# Altium project PCB_Project1.PrjPCB
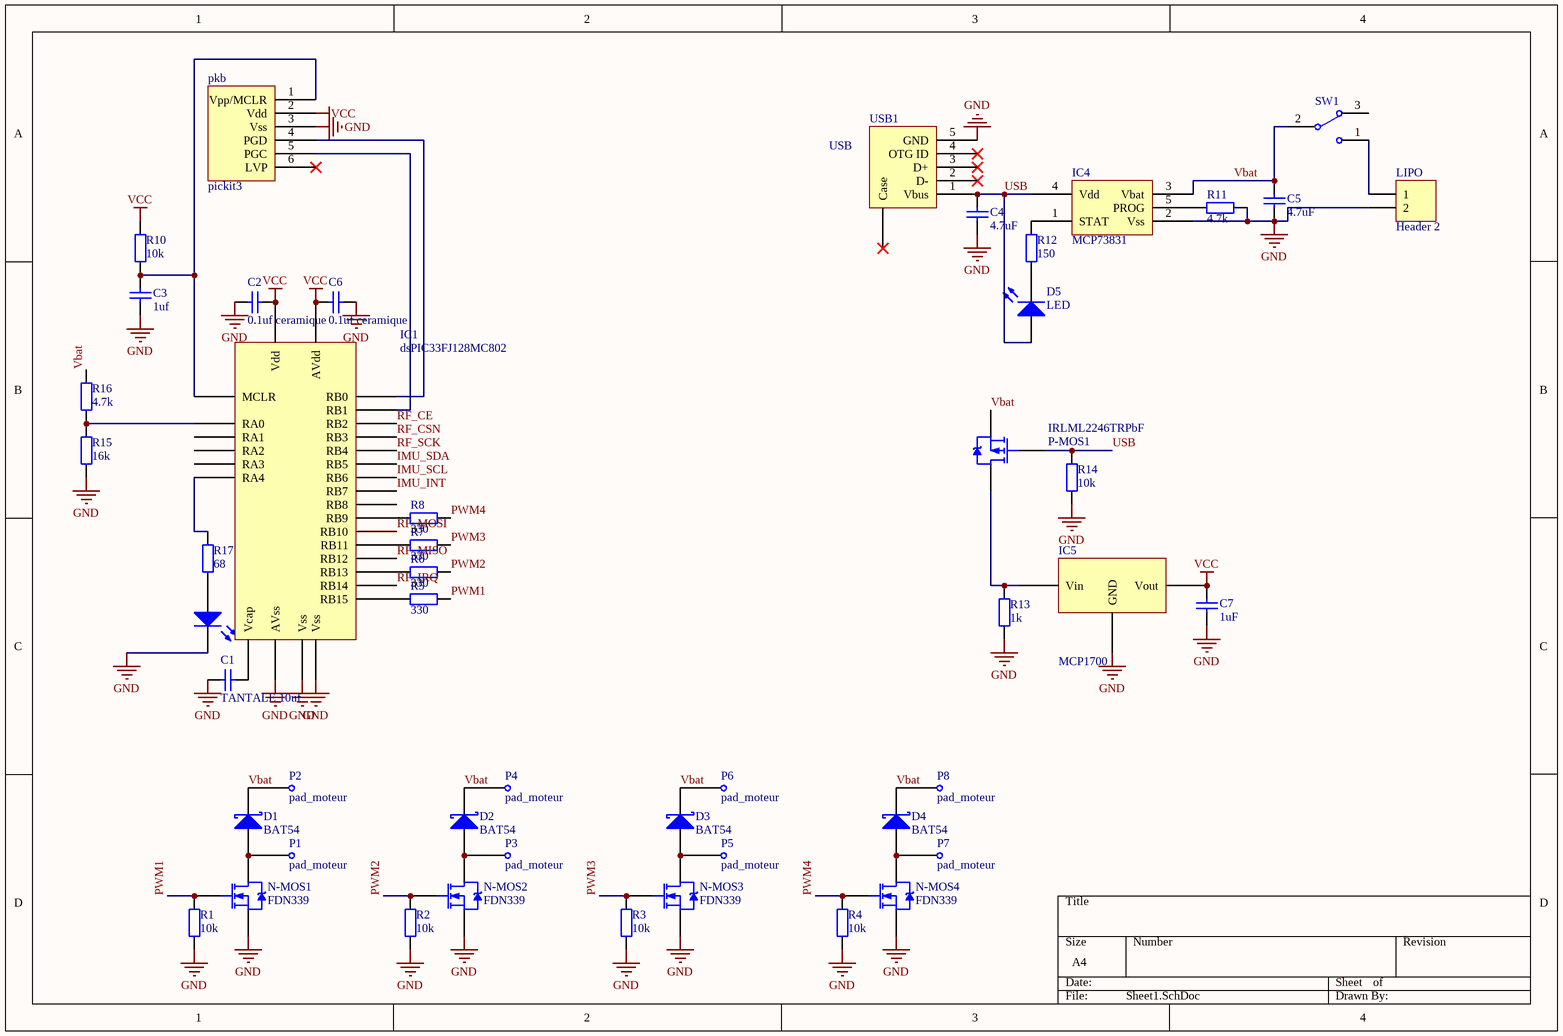
[diagram p0: Sheet1.SchDoc]
2 sheets, 71 parts. Net scope: global (net labels, ports and power ports of the same name join across sheets).
Board file: PCB1_jeremy.PcbDoc
Sheets:
  Sheet1.SchDoc
  Sheet2.SchDoc

## Sheet Sheet1.SchDoc
size A4; PageSetup: Record=PageOptions|CenterHorizontal=True|CenterVertical=True|PrintScale=0.97|XCorrection=1.00|YCorrection=1.00|PrintKind=1|BorderSize=5000000|LeftOffset=0|BottomOffset=0|Orientation=2|PaperLength=1000|PaperWidth=1000|Scale=100|PaperSource=7|PrintQuality=-4|MediaType=1|DitherType=1|PaperKind=A4|PrintScaleMode=1

### Parts
C1  TANTALE 10uf  [cms805]
C2  0.1uf ceramique  [cms805]
C3  1uf  [cms805]
C4  4.7uF  [cms805]
C5  4.7uF  [cms805]
C6  0.1uf ceramique  [cms805]
C7  1uF  [cms805]
D1  BAT54  [SOT23]
D2  BAT54  [SOT23]
D3  BAT54  [SOT23]
D4  BAT54  [SOT23]
D5  LED  [cms1206]
D6  LED  [cms1206]
IC1  dsPIC33FJ128MC802  [28QFN-S]
IC4  MCP73831  [SOT23-5]
IC5  MCP1700  [SOT89]
IRLML2246TRPbF  P-MOS1  [SOT23]
LIPO  Header 2  [HDR1X2]
N-MOS1  FDN339  [SuperSOT]
N-MOS2  FDN339  [SuperSOT]
N-MOS3  FDN339  [SuperSOT]
N-MOS4  FDN339  [SuperSOT]
P1  pad_moteur  [PAD]
P2  pad_moteur  [PAD]
P3  pad_moteur  [PAD]
P4  pad_moteur  [PAD]
P5  pad_moteur  [PAD]
P6  pad_moteur  [PAD]
P7  pad_moteur  [PAD]
P8  pad_moteur  [PAD]
pkb  pickit3  [pickit3]
R1  10k  [cms805]
R2  10k  [cms805]
R3  10k  [cms805]
R4  10k  [cms805]
R5  330  [cms805]
R6  330  [cms805]
R7  330  [cms805]
R8  330  [cms805]
R10  10k  [cms805]
R11  4.7k  [cms805]
R12  150  [cms805]
R13  1k  [cms805]
R14  10k  [cms805]
R15  16k  [cms805]
R16  4.7k  [cms805]
R17  68  [cms805]
SW1  (no value)  [inverseur]
USB1  USB  [USB_con]

### Nets
GND: C1.1 C2.1 C3.1 C4.1 C5.1 C6.2 C7.1 D6.2(K) IC1.8(Vss) IC1.19(Vss) IC1.27(AVss) IC4.2(Vss) IC5.1(GND) LIPO.2 N-MOS1.3(S) N-MOS2.3(S) N-MOS3.3(S) N-MOS4.3(S) pkb.3(Vss) R1.1 R2.1 R3.1 R4.1 R11.1 R13.1 R14.1 R15.1 USB1.5(GND)
VCC: C2.2 C6.1 C7.2 IC1.13(Vdd) IC1.28(AVdd) IC5.3(Vout) pkb.2(Vdd) R10.2
IMU_INT: IC1.16(RB7)
IMU_SCL: IC1.15(RB6)
IMU_SDA: IC1.14(RB5)
PWM1: N-MOS1.1(G) R1.2 R5.2
PWM2: N-MOS2.1(G) R2.2 R6.2
PWM3: N-MOS3.1(G) R3.2 R7.2
PWM4: N-MOS4.1(G) R4.2 R8.2
RF_CE: IC1.6(RB2)
RF_CSN: IC1.7(RB3)
RF_IRQ: IC1.25(RB14)
RF_MISO: IC1.23(RB12)
RF_MOSI: IC1.21(RB10)
RF_SCK: IC1.11(RB4)
USB: C4.2 D5.1(A) IC4.4(Vdd) IRLML2246TRPbF.1(G) R14.2 USB1.1(Vbus)
Vbat: C5.2 D1.2(K) D2.2(K) D3.2(K) D4.2(K) IC4.3(Vbat) IRLML2246TRPbF.3(S) P2.1 P4.1 P6.1 P8.1 R16.2 SW1.2
NetC1_2: C1.2 IC1.20(Vcap)
NetC3_2: C3.2 IC1.1(MCLR) pkb.1(Vpp/MCLR) R10.1
NetD1_1: D1.1(A) N-MOS1.2(D) P1.1
NetD2_1: D2.1(A) N-MOS2.2(D) P3.1
NetD3_1: D3.1(A) N-MOS3.2(D) P5.1
NetD4_1: D4.1(A) N-MOS4.2(D) P7.1
NetD5_2: D5.2(K) R12.2
NetD6_1: D6.1(A) R17.1
NetIC1_2: IC1.2(RA0) R15.2 R16.1
NetIC1_4: IC1.4(RB0) pkb.4(PGD)
NetIC1_5: IC1.5(RB1) pkb.5(PGC)
NetIC1_12: IC1.12(RA4) R17.2
NetIC1_18: IC1.18(RB9) R8.1
NetIC1_22: IC1.22(RB11) R7.1
NetIC1_24: IC1.24(RB13) R6.1
NetIC1_26: IC1.26(RB15) R5.1
NetIC4_1: IC4.1(STAT) R12.1
NetIC4_5: IC4.5(PROG) R11.2
NetIC5_2: IC5.2(Vin) IRLML2246TRPbF.2(D) R13.2
NetLIPO_1: LIPO.1 SW1.1

Not connected (* = marked no-connect by the designer): IC1 3(RA1) 9(RA2) 10(RA3) 17(RB8); pkb 6(LVP)*; SW1 3; USB1 0(Case)* 2(D-)* 3(D+)* 4(OTG_ID)*

### Library data of the parts
C1-C7 = Capa
D1-D4 = Schottky BAT54
IC1 = dsPIC33FJ128MC802: pin to pad: 1>26 2>27 3>28 4>1 5>2 6>3 7>4 8>5 9>6 10>7 11>8 12>9 13>10 14>11 15>12 16>13 17>14 18>15 19>16 20>17 21>18 22>19 23>20 24>21 25>22 26>23 27>24 28>25
IC4 = MCP73831 Li-Po
IRLML2246TRPbF = P-MOS
LIPO = Header 2: Header, 2-Pin; LatestRevisionDate: 17-Jul-2002; LatestRevisionNote: Re-released for DXP Platform.; Publisher: Altium Limited
N-MOS1-N-MOS4 = N-MOS FDN339
R1-R8 R10-R17 = Resistance
SW1 = switch

## Sheet Sheet2.SchDoc
size A4
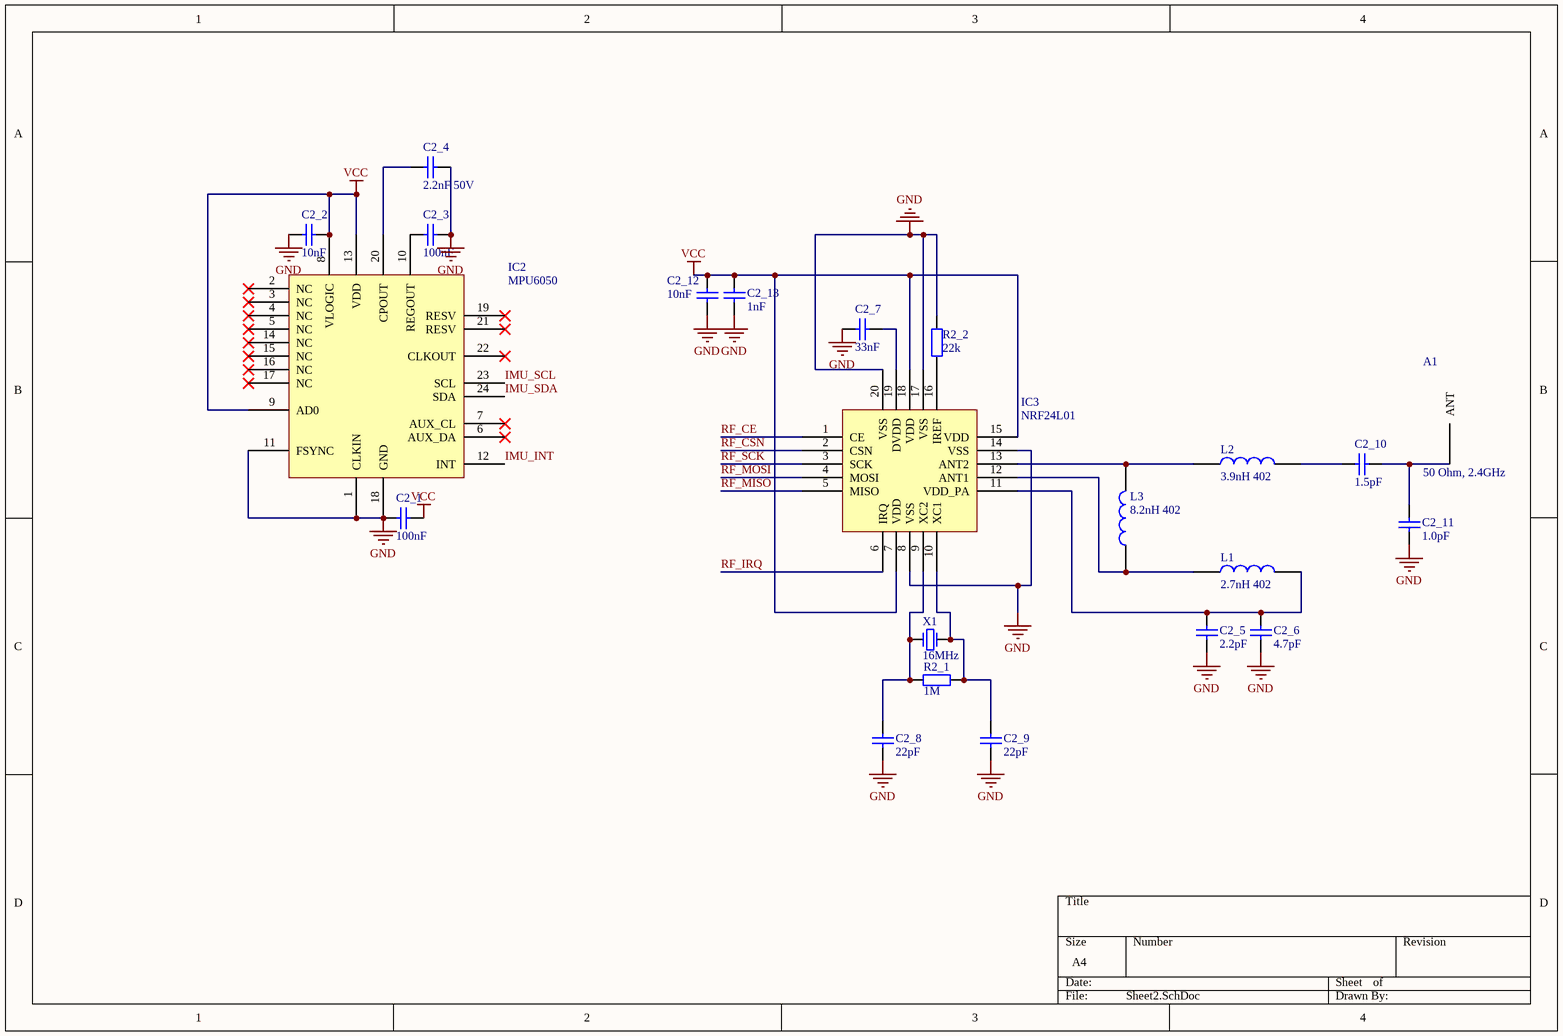
[diagram p1: Sheet2.SchDoc]

### Parts
A1  50 Ohm, 2.4GHz  [Antene]
C2_1  100nF  [cms805]
C2_2  10nF  [cms805]
C2_3  100nF  [cms805]
C2_4  2.2nF 50V  [cms805]
C2_5  2.2pF  [cms805]
C2_6  4.7pF  [cms805]
C2_7  33nF  [cms805]
C2_8  22pF  [cms805]
C2_9  22pF  [cms805]
C2_10  1.5pF  [cms805]
C2_11  1.0pF  [cms805]
C2_12  10nF  [cms805]
C2_13  1nF  [cms805]
IC2  MPU6050  [24QFN]
IC3  NRF24L01  [20QFN]
L1  2.7nH 402  [CMS402]
L2  3.9nH 402  [CMS402]
L3  8.2nH 402  [CMS402]
R2_1  1M  [cms805]
R2_2  22k  [cms805]
X1  16MHz  [Quartz]

### Nets
GND: C2_1.1 C2_2.2 C2_3.2 C2_4.1 C2_5.2 C2_6.2 C2_7.2 C2_8.1 C2_9.1 C2_11.2 C2_12.2 C2_13.2 IC2.1(CLKIN) IC2.11(FSYNC) IC2.18(GND) IC3.8(VSS) IC3.14(VSS) IC3.17(VSS) IC3.20(VSS) R2_2.2
VCC: C2_1.2 C2_2.1 C2_12.1 C2_13.1 IC2.8(VLOGIC) IC2.9(AD0) IC2.13(VDD) IC3.7(VDD) IC3.15(VDD) IC3.18(VDD)
IMU_INT: IC2.12(INT)
IMU_SCL: IC2.23(SCL)
IMU_SDA: IC2.24(SDA)
RF_CE: IC3.1(CE)
RF_CSN: IC3.2(CSN)
RF_IRQ: IC3.6(IRQ)
RF_MISO: IC3.5(MISO)
RF_MOSI: IC3.4(MOSI)
RF_SCK: IC3.3(SCK)
NetA1_1: A1.1(ANT) C2_10.1 C2_11.1
NetC2_3_1: C2_3.1 IC2.10(REGOUT)
NetC2_4_2: C2_4.2 IC2.20(CPOUT)
NetC2_5_1: C2_5.1 C2_6.1 IC3.11(VDD_PA) L1.2
NetC2_7_1: C2_7.1 IC3.19(DVDD)
NetC2_8_2: C2_8.2 IC3.9(XC2) R2_1.1 X1.1
NetC2_9_2: C2_9.2 IC3.10(XC1) R2_1.2 X1.2
NetC2_10_2: C2_10.2 L2.2
NetIC3_12: IC3.12(ANT1) L1.1 L3.1
NetIC3_13: IC3.13(ANT2) L2.1 L3.2
NetIC3_16: IC3.16(IREF) R2_2.1

Not connected (* = marked no-connect by the designer): IC2 2(NC)* 3(NC)* 4(NC)* 5(NC)* 6(AUX_DA)* 7(AUX_CL)* 14(NC)* 15(NC)* 16(NC)* 17(NC)* 19(RESV)* 21(RESV)* 22(CLKOUT)*

### Library data of the parts
A1 = Antenne
C2_1-C2_13 = Capa
L1-L3 = Inductance
R2_1 R2_2 = Resistance
X1 = Quartz

## Nets that join several sheets
GND: Sheet1 (28 pins), Sheet2 (20 pins)
VCC: Sheet1 (8 pins), Sheet2 (10 pins)
IMU_INT: Sheet1 (IC1.16), Sheet2 (IC2.12)
IMU_SCL: Sheet1 (IC1.15), Sheet2 (IC2.23)
IMU_SDA: Sheet1 (IC1.14), Sheet2 (IC2.24)
RF_CE: Sheet1 (IC1.6), Sheet2 (IC3.1)
RF_CSN: Sheet1 (IC1.7), Sheet2 (IC3.2)
RF_IRQ: Sheet1 (IC1.25), Sheet2 (IC3.6)
RF_MISO: Sheet1 (IC1.23), Sheet2 (IC3.5)
RF_MOSI: Sheet1 (IC1.21), Sheet2 (IC3.4)
RF_SCK: Sheet1 (IC1.11), Sheet2 (IC3.3)